# EasyEDA schematic SCH_Hand_2024-01-24.json
TITLE: Sheet_1; REV: 1.0; Date: 2024-01-22; Sheet: 1/1; Drawn By: mdrakibislam719; Company: Your Company
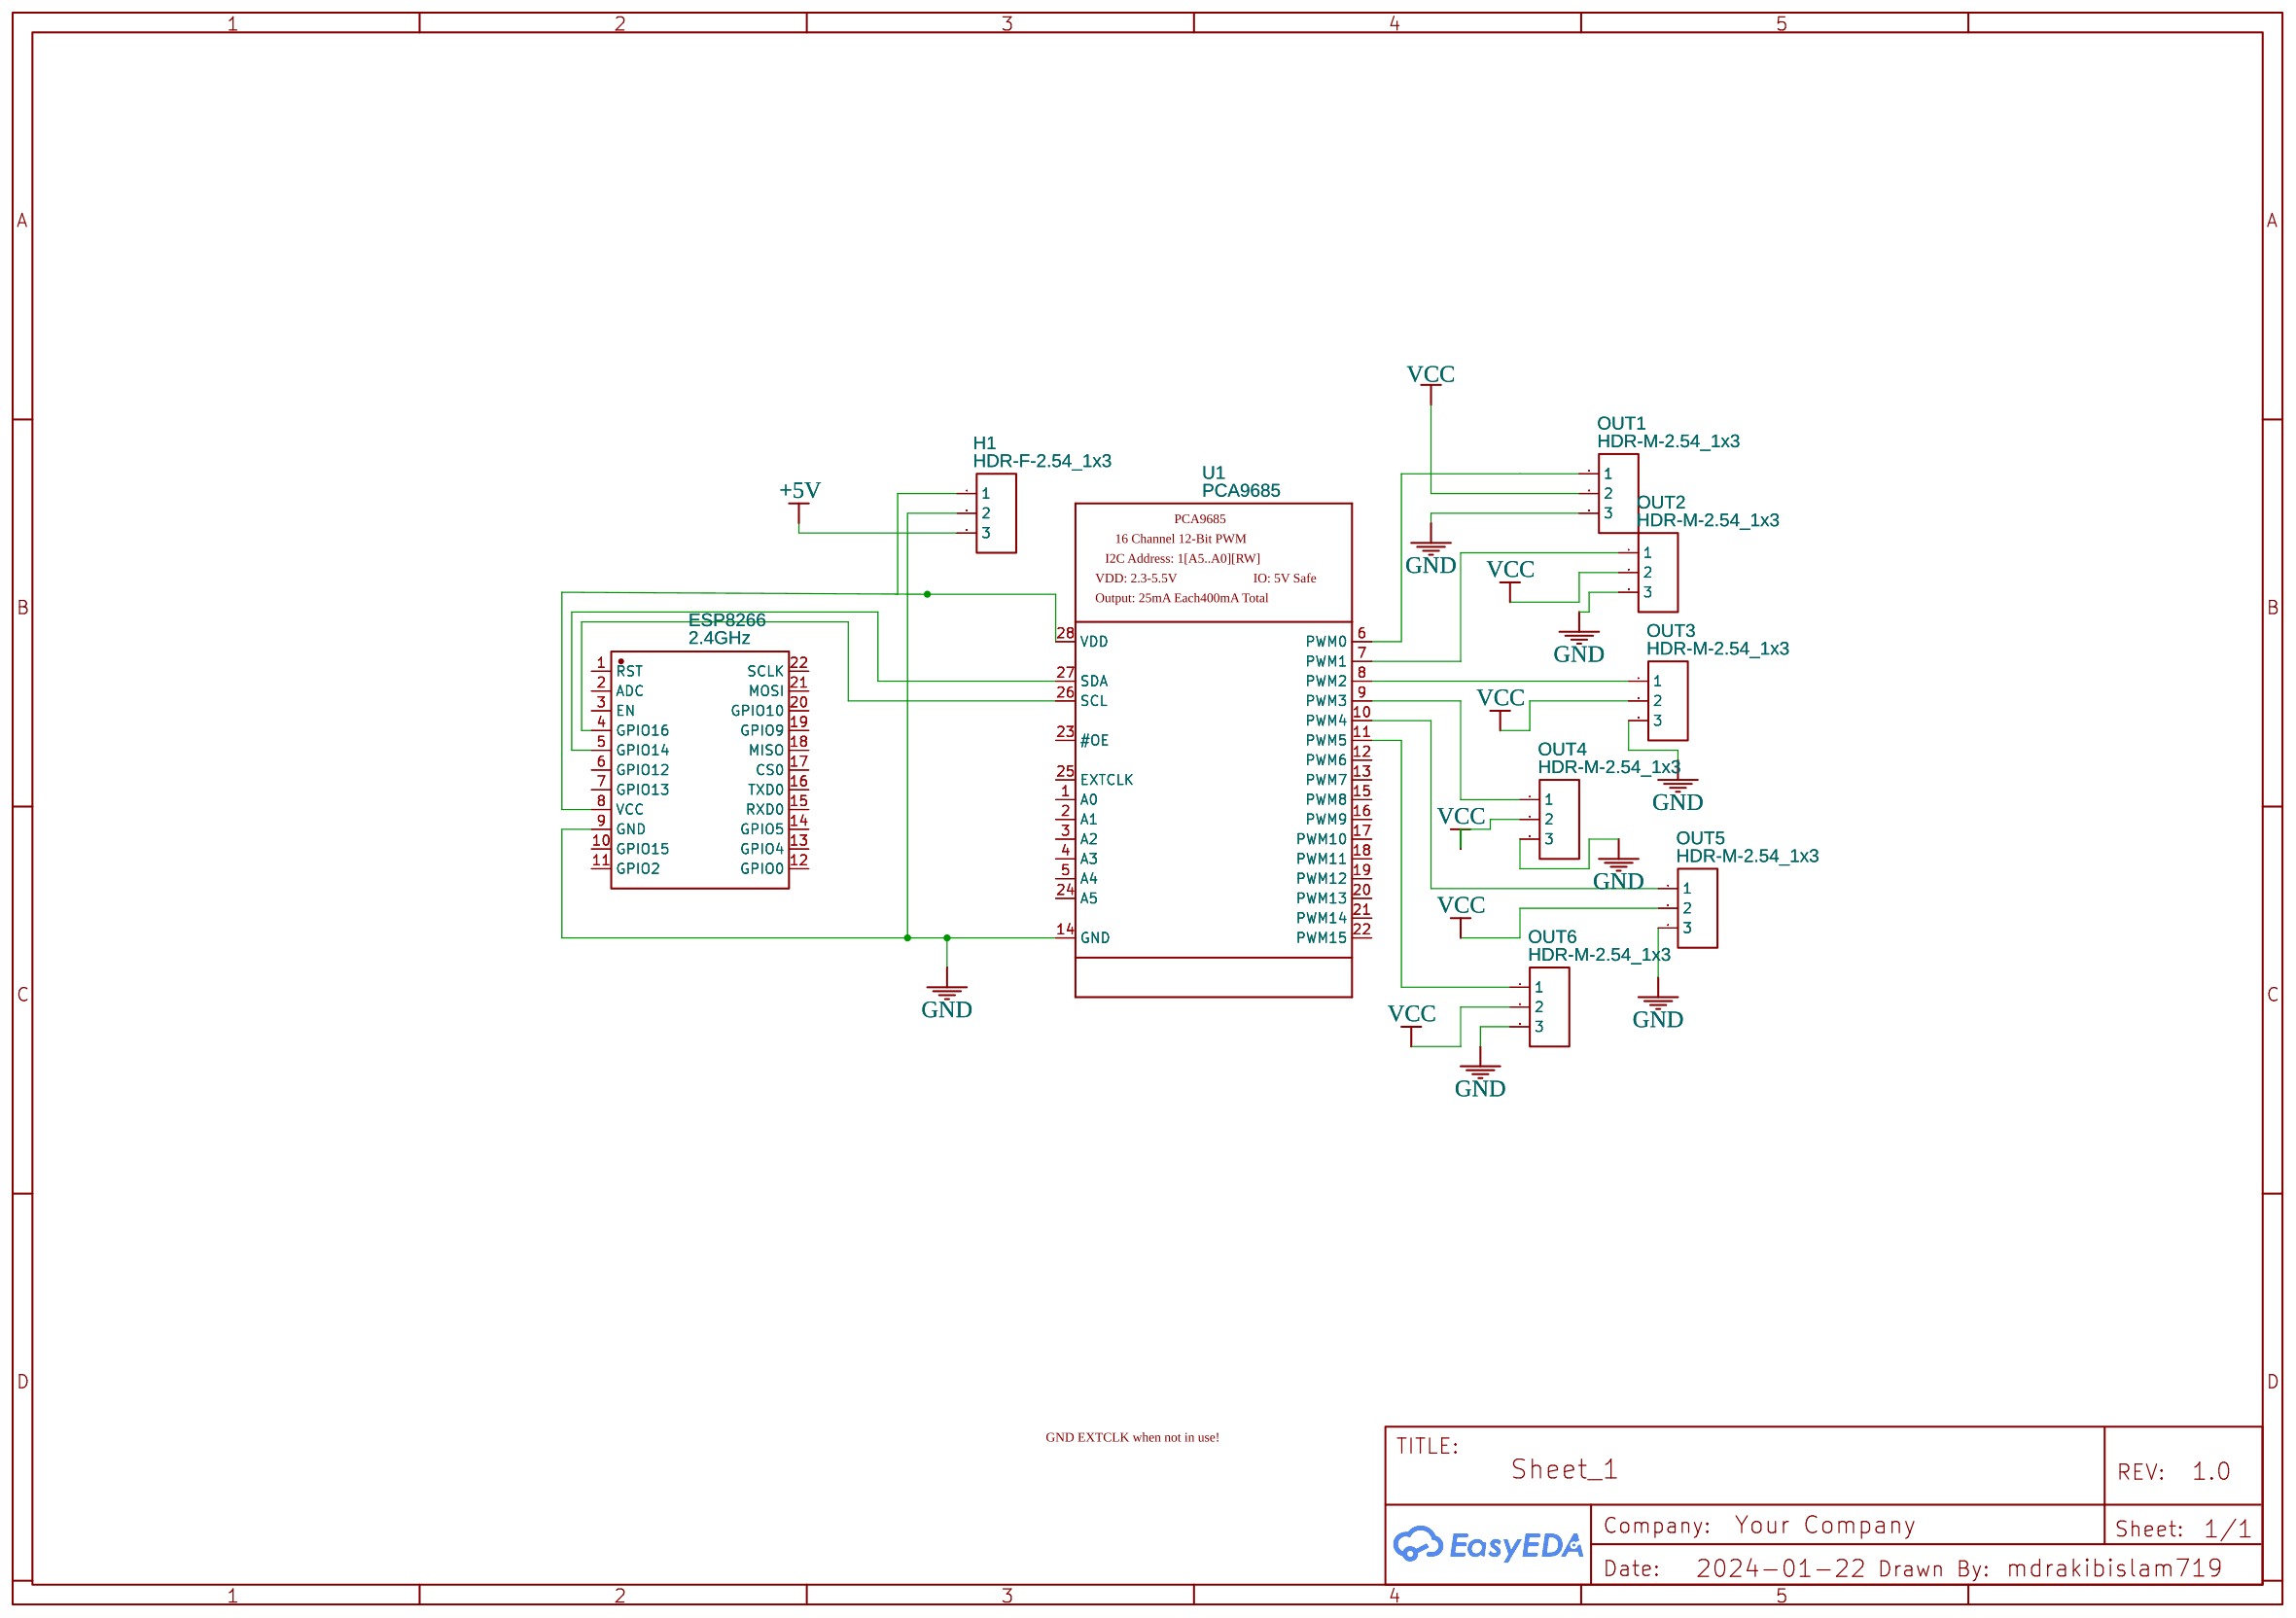
[diagram p0: schematic sheet]

## Parts
ESP8266  2.4GHz  [WIFIM-SMD_ESP-12F-ESP8266MOD]
H1  HDR-F-2.54_1x3  [HDR-F-2.54_1X3]
OUT1  HDR-M-2.54_1x3  [HDR-M-2.54_1X3]
OUT2  HDR-M-2.54_1x3  [HDR-M-2.54_1X3]
OUT3  HDR-M-2.54_1x3  [HDR-M-2.54_1X3]
OUT4  HDR-M-2.54_1x3  [HDR-M-2.54_1X3]
OUT5  HDR-M-2.54_1x3  [HDR-M-2.54_1X3]
OUT6  HDR-M-2.54_1x3  [HDR-M-2.54_1X3]
U1  PCA9685  [TSSOP28]

## Library data of the parts
ESP8266 = ESP-12F(ESP8266MOD): Supplier: LCSC; Manufacturer: Ai-Thinker(安信可); Supplier Part: C82891; JLCPCB Part Class: Extended Part
H1 = HDR-F-2.54_1x3: Supplier Part: C146690; Supplier: LCSC; Contributor: LCEDA_Lib
OUT1-OUT6 = HDR-M-2.54_1x3: Supplier Part: C180248; Supplier: LCSC; Contributor: LCEDA_Lib
U1 = PCA9685: Contributor: Adafruit

## Nets
+5V: H1.3
GND: ESP8266.9(GND) H1.2 OUT1.3 OUT2.3 OUT3.3 OUT4.3 OUT5.3 OUT6.3 U1.14(GND)
VCC: OUT1.2 OUT2.2 OUT3.2 OUT4.2 OUT5.2 OUT6.2
Net-(ESP8266-4): ESP8266.4(GPIO16) U1.26(SCL)
Net-(ESP8266-5): ESP8266.5(GPIO14) U1.27(SDA)
Net-(ESP8266-8): ESP8266.8(VCC) U1.28(VDD)
Net-(OUT1-1): OUT1.1 U1.6(PWM0)
Net-(OUT2-1): OUT2.1 U1.7(PWM1)
Net-(OUT3-1): OUT3.1 U1.8(PWM2)
Net-(OUT4-1): OUT4.1 U1.9(PWM3)
Net-(OUT5-1): OUT5.1 U1.10(PWM4)
Net-(OUT6-1): OUT6.1 U1.11(PWM5)

Not connected (* = marked no-connect by the designer): ESP8266 1(RST) 2(ADC) 3(EN) 6(GPIO12) 7(GPIO13) 10(GPIO15) 11(GPIO2) 12(GPIO0) 13(GPIO4) 14(GPIO5) 15(RXD0) 16(TXD0) 17(CS0) 18(MISO) 19(GPIO9) 20(GPIO10) 21(MOSI) 22(SCLK); H1 1; U1 1(A0) 2(A1) 3(A2) 4(A3) 5(A4) 12(PWM6) 13(PWM7) 15(PWM8) 16(PWM9) 17(PWM10) 18(PWM11) 19(PWM12) 20(PWM13) 21(PWM14) 22(PWM15) 23(#OE) 24(A5) 25(EXTCLK)
